# EAGLE design W034X (EAGLE 6.6.0)
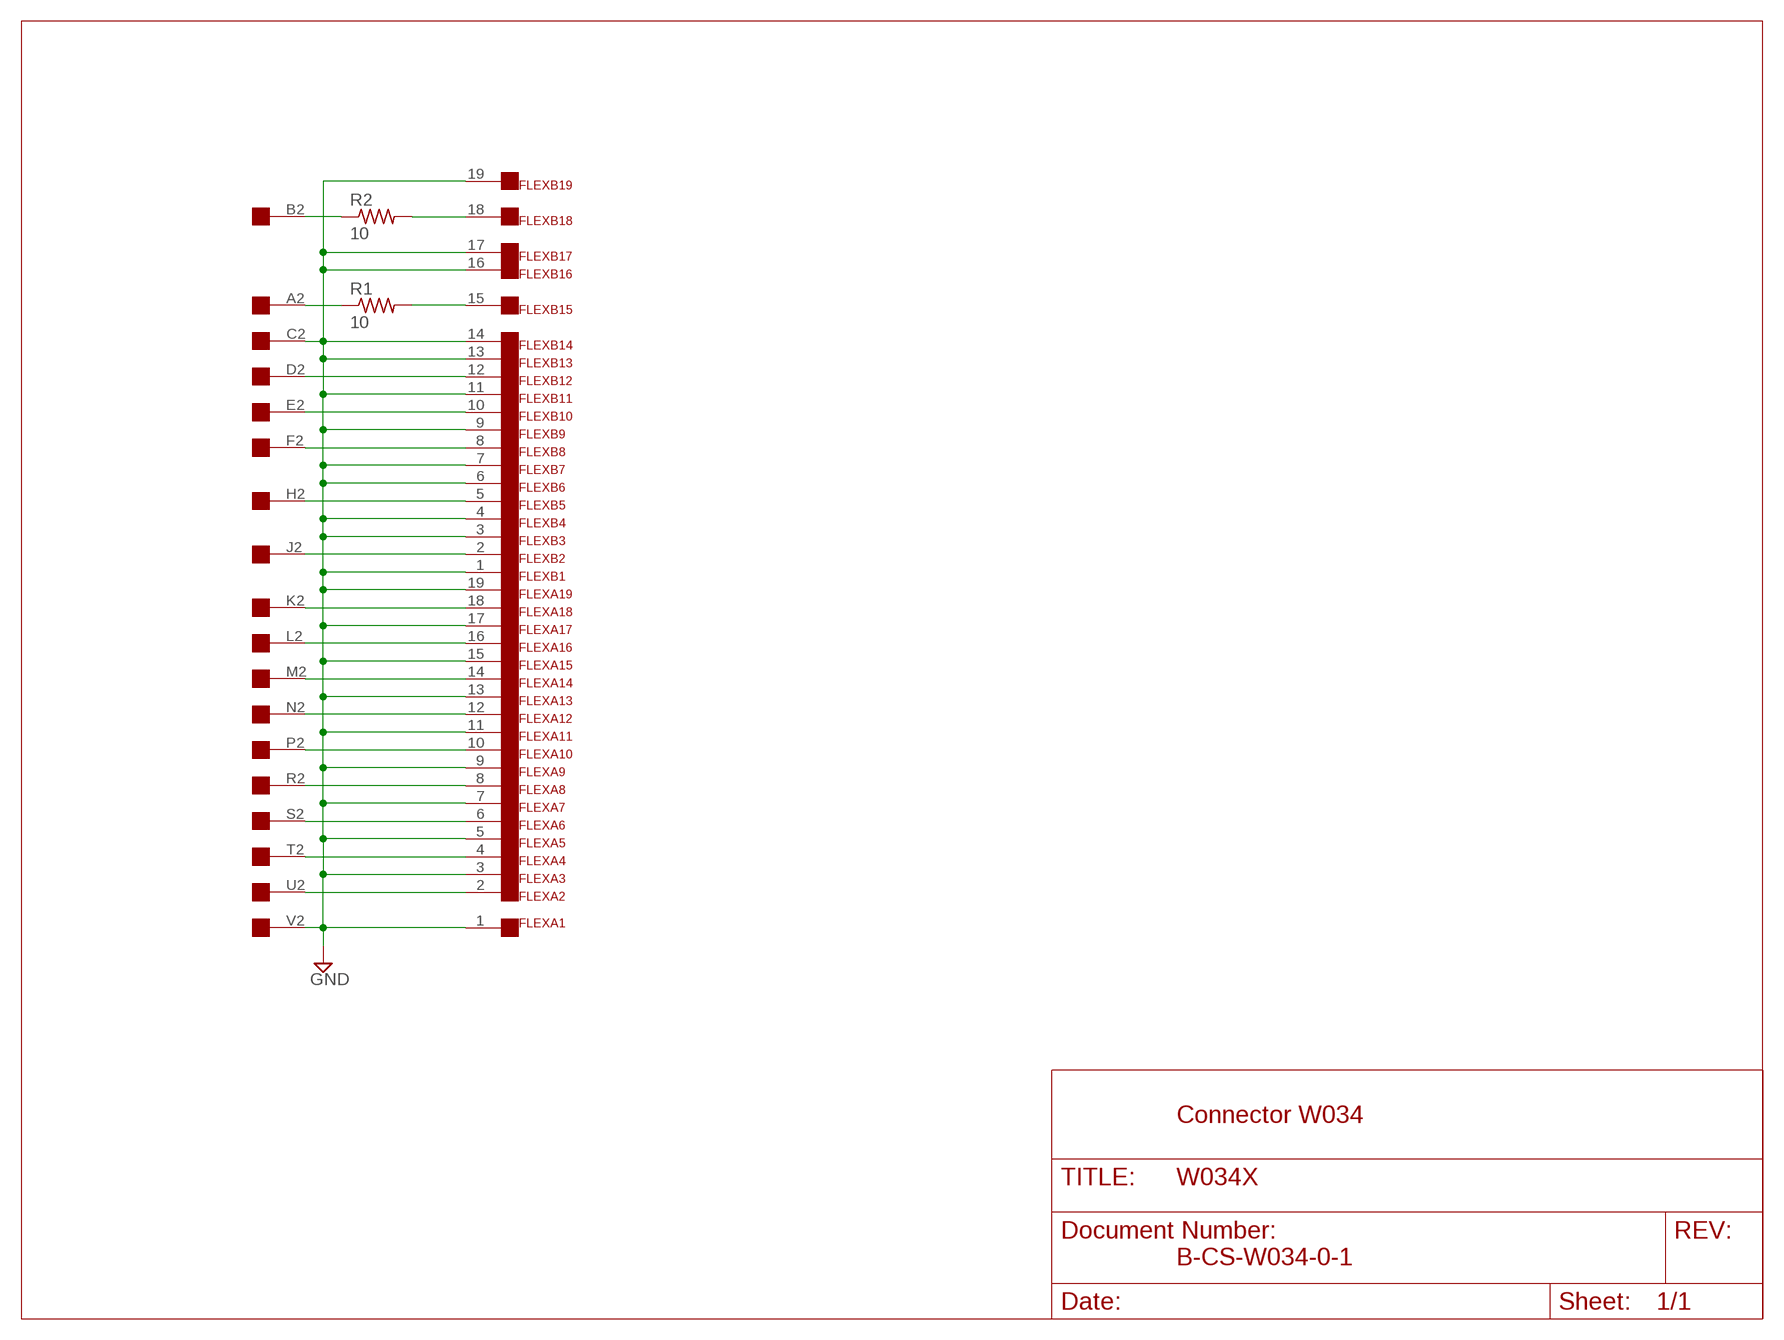
[diagram p0: schematic, sheet 1]

## Parts
FLEXA  FLEX19  [FLEX19]
FLEXB  FLEX19  [FLEX19]
R1  10  R-US_0207/10  [0207/10]
R2  10  R-US_0207/10  [0207/10]
U$2  EDGE-1  [EDGE-CON1]

## Nets
GND [Supply]: FLEXA.1 FLEXA.3 FLEXA.5 FLEXA.7 FLEXA.9 FLEXA.11 FLEXA.13 FLEXA.15 FLEXA.17 FLEXA.19 FLEXB.1 FLEXB.3 FLEXB.4 FLEXB.6 FLEXB.7 FLEXB.9 FLEXB.11 FLEXB.13 FLEXB.14 FLEXB.16 FLEXB.17 FLEXB.19 U$2.C2 U$2.V2
N$1 [Supply]: FLEXB.10 U$2.E2
N$2 [Supply]: FLEXB.5 U$2.H2
N$3 [Supply]: FLEXA.18 U$2.K2
N$4 [Supply]: FLEXA.14 U$2.M2
N$5 [Supply]: FLEXA.10 U$2.P2
N$6 [Supply]: FLEXA.6 U$2.S2
N$7 [Supply]: FLEXA.4 U$2.T2
N$8 [Supply]: FLEXA.8 U$2.R2
N$9: FLEXB.12 U$2.D2
N$10: R2.1 U$2.B2
N$11: R1.1 U$2.A2
N$12: FLEXB.18 R2.2
N$13: FLEXB.15 R1.2
N$14 [Supply]: FLEXA.2 U$2.U2
N$16 [Supply]: FLEXB.8 U$2.F2
N$17 [Supply]: FLEXB.2 U$2.J2
N$18 [Supply]: FLEXA.16 U$2.L2
N$19 [Supply]: FLEXA.12 U$2.N2

## Notes on the sheet
- Connector W034
- B-CS-W034-0-1

## Library data of the parts
FLEXA FLEXB = dec-con:FLEX19: 19 pin Flexprint Connection
R1 R2 = rcl:R-US_: RESISTOR, American symbol
U$2 = dec-con:EDGE-1: Single-Sided DEC Edge Connector -- (side 2)

## Net classes
0 default: width 0.813 mm
1 Supply: width 0.813 mm

## Board
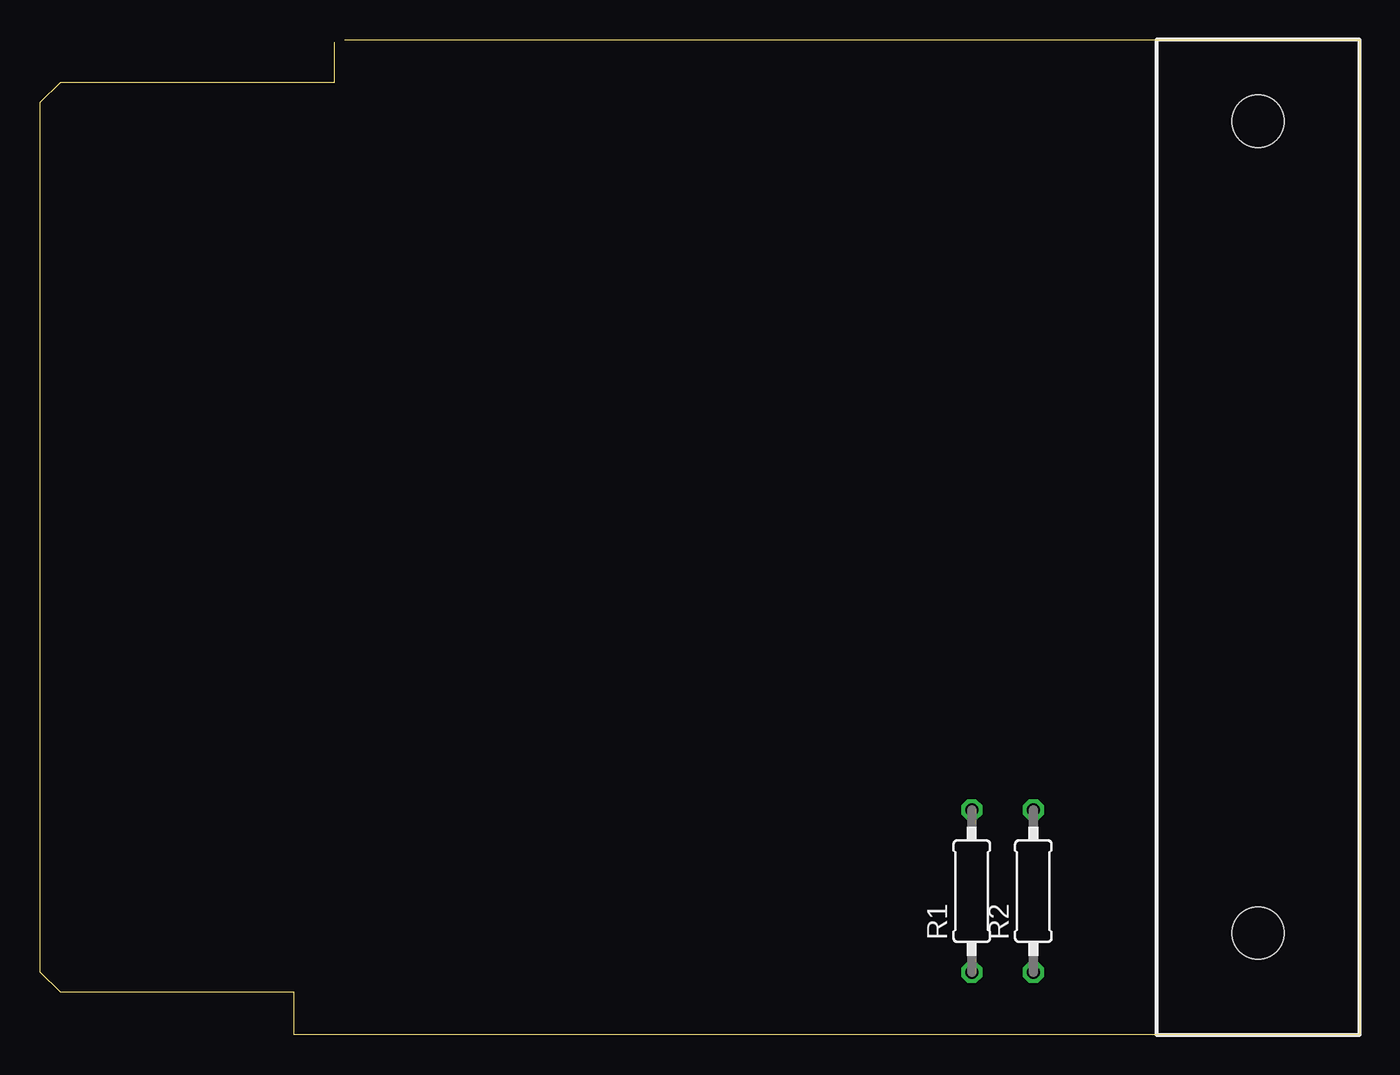
[diagram p1: board, top side]
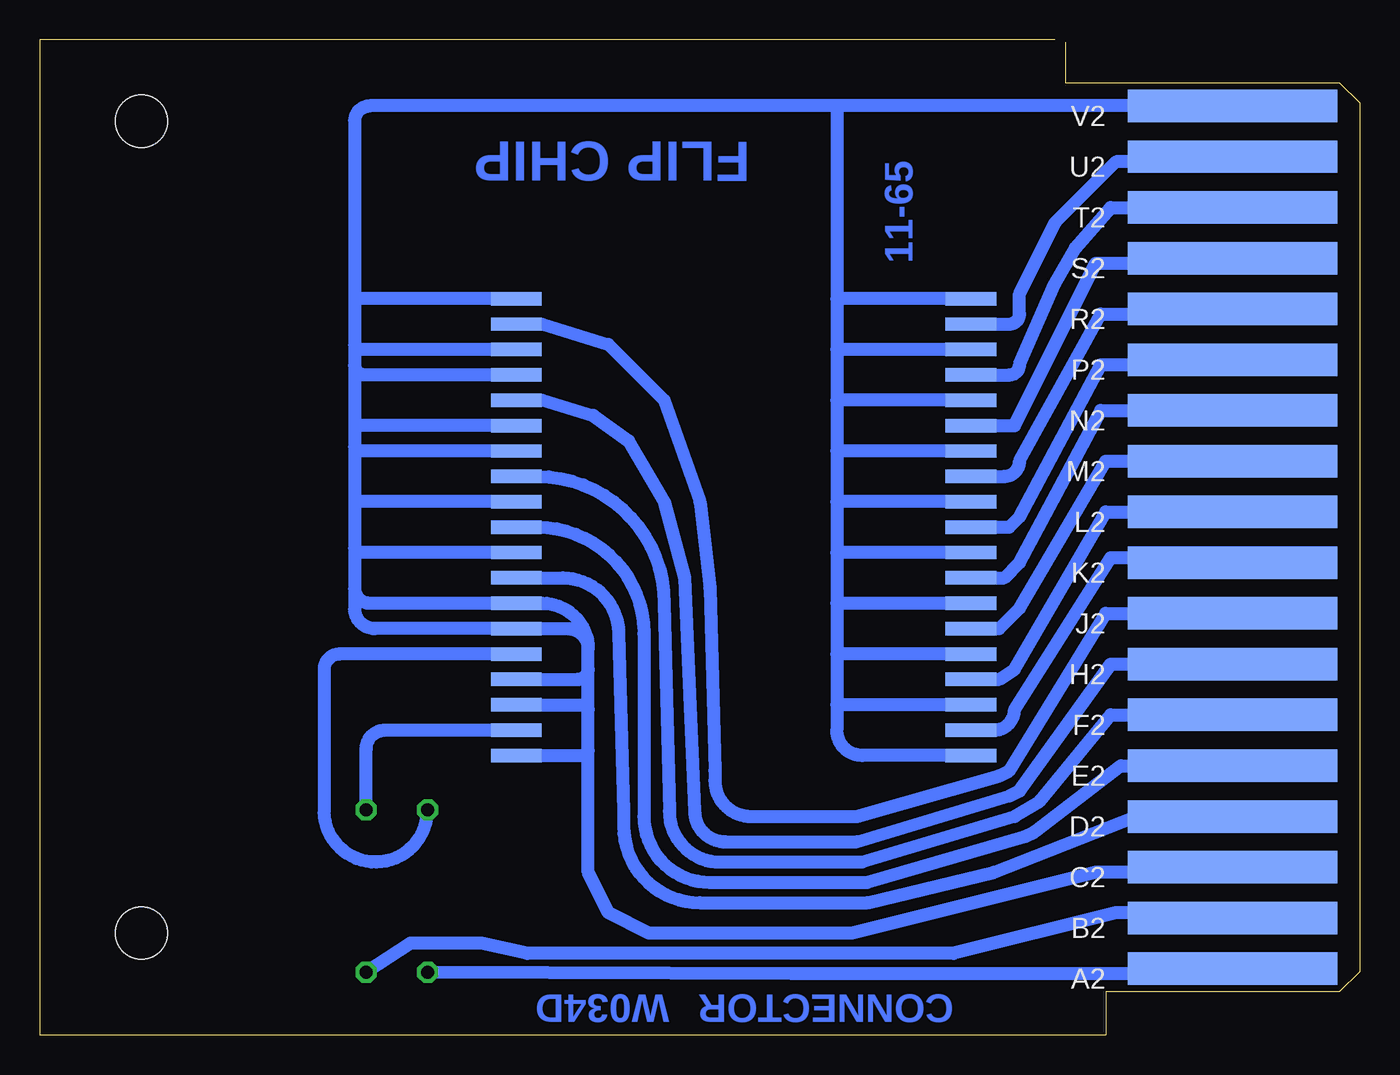
[diagram p2: board, bottom side, seen from below]

Size 82.55 x 62.23 mm. Coordinates in mm from the lower left corner, seen from the top.
Outline: 19.05,62.23 82.55,62.23 82.55,0 15.88,0
Copper layers (1+16): Top 0.035mm / dielectric 1.5mm / Bottom 0.035mm
Design rules "16mils": minimum track width 16mil, minimum drill 32mil, track to track 15mil, track to pad 10mil, pad to pad 10mil, via to via 10mil, smd to smd 10mil, copper to edge 13mil, drill to drill 10mil, minimum pad ring 10mil, minimum via ring 8mil, stop-mask expansion 0mil, vias tented up to drill 0mil, thermal gap 10mil
Holes 3.25 mm at 76.2,6.35 76.2,57.15

### Footprints (pad centres in the part's own frame; a part is rotated, then mirrored left to right if it is on the bottom)
FLEX19 = smd 3.175 x 0.838: 1 0,14.287; 2 0,12.7; 3 0,11.113; 4 0,9.525; 5 0,7.938; 6 0,6.35; 7 0,4.763; 8 0,3.175; 9 0,1.587; 10 0,0; 11 0,-1.587; 12 0,-3.175; 13 0,-4.763; 14 0,-6.35; 15 0,-7.938; 16 0,-9.525; 17 0,-11.113; 18 0,-12.7; 19 0,-14.287
0207/10 = drill 0.813 octagon: 1 -5.08,0; 2 5.08,0
EDGE-CON1 = smd 13.106 x 2.032 bottom: A2 7.938,4.128; B2 7.938,7.303; C2 7.938,10.477; D2 7.938,13.652; E2 7.938,16.828; F2 7.938,20.003; H2 7.938,23.177; J2 7.938,26.352; K2 7.938,29.527; L2 7.938,32.703; M2 7.938,35.877; N2 7.938,39.053; P2 7.938,42.227; R2 7.938,45.403; S2 7.938,48.578; T2 7.938,51.752; U2 7.938,54.928; V2 7.938,58.102

### Placement (x,y rotation side)
FLEXA  24.3,31.75 0 bottom
FLEXB  52.75,31.75 0 bottom
R1  58.29,8.97 90 top
R2  62.14,8.97 90 top
U$2  0,0 0 top

### Tracks (layer width: path | path; a pad name or v marks a point on that pad's centre or on a via)
GND
  Bottom 0.813: U$2.V2 32.7,58.1 | 32.7,58.1 32.7,46.04 | 32.7,46.04 32.7,42.86 | 32.7,42.86 32.7,39.69 | 32.7,39.69 32.7,36.51 | 32.7,36.51 32.7,33.34 | 32.7,33.34 32.7,30.16 | 32.7,30.16 32.7,26.99 | 32.7,26.99 32.7,23.81 | 32.7,23.81 32.7,20.64 | 32.7,20.64 32.7,19.05 arc-90 31.11,17.46 FLEXA.19 | 32.7,58.1 61.91,58.1 arc-90 62.87,57.15 62.87,45.72 | 62.87,45.72 62.87,43.18 | 62.87,43.18 62.87,41.91 | 62.87,41.91 62.87,38.1 | 62.87,38.1 62.87,36.83 | 62.87,36.83 62.87,33.02 | 62.87,33.02 62.87,30.48 | 62.87,30.48 62.87,27.94 | 62.87,27.94 62.87,26.67 arc-90 61.59,25.4 53.34,25.4 | FLEXA.17 32.7,20.64 | FLEXA.15 32.7,23.81 | FLEXA.13 32.7,26.99 | FLEXA.11 32.7,30.16 | FLEXA.9 32.7,33.34 | FLEXA.7 32.7,36.51 | FLEXA.5 32.7,39.69 | FLEXA.3 32.7,42.86 | FLEXA.1 32.7,46.04 | U$2.C2 8.89,10.16 16.51,10.16 31.75,6.35 44.45,6.35 46.99,7.62 48.26,10.16 48.26,17.78 | 48.26,17.78 48.26,20.32 | 48.26,20.32 48.26,22.86 | 48.26,22.86 48.26,24.13 | FLEXB.19 48.58,17.46 arc-90 48.26,17.78 | FLEXB.17 48.58,20.64 arc90 48.26,20.32 | FLEXB.16 48.9,22.23 arc-90 48.26,22.86 | FLEXB.14 49.53,25.4 arc90 48.26,24.13 | 48.26,24.13 arc-90 51.12,26.99 FLEXB.13 61.91,26.99 arc90 62.87,27.94 | FLEXB.1 62.55,46.04 arc-90 62.87,45.72 | FLEXB.3 62.55,42.86 arc90 62.87,43.18 | FLEXB.4 62.23,41.27 arc90 62.87,41.91 | FLEXB.6 62.87,38.1 | FLEXB.7 62.55,36.51 arc90 62.87,36.83 | FLEXB.9 62.55,33.34 arc-90 62.87,33.02 | FLEXB.11 62.55,30.16 arc90 62.87,30.48
N$1
  Bottom 0.813: FLEXB.10 51.44,31.75 arc90 44.77,25.08 44.77,13.65 arc-90 40.64,9.53 30.8,9.53 20.95,12.38 20.32,12.7 14.92,16.83 U$2.E2
N$2
  Bottom 0.813: FLEXB.5 51.12,39.69 47.94,38.73 45.72,37.15 43.5,33.34 42.23,28.57 41.59,13.97 arc-90 39.69,12.06 31.43,12.06 21.91,14.92 21.27,15.24 15.56,23.18 U$2.H2
N$3
  Bottom 0.813: FLEXA.18 22.86,19.05 arc-90 21.59,20.32 15.56,29.84 8.57,29.84 U$2.K2
N$4
  Bottom 0.813: FLEXA.14 22.54,25.4 21.27,26.67 15.88,35.88 U$2.M2
N$5
  Bottom 0.813: FLEXA.10 21.91,31.75 21.27,32.38 16.19,41.91 8.57,41.91 U$2.P2
N$6
  Bottom 0.813: FLEXA.6 21.59,38.1 16.51,48.26 8.89,48.26 U$2.S2
N$7
  Bottom 0.813: FLEXA.4 21.91,41.27 arc-90 21.27,41.91 19.05,46.99 17.78,49.21 15.56,51.75 U$2.T2
N$8
  Bottom 0.813: FLEXA.8 22.23,34.92 arc-90 21.27,35.88 16.19,45.09 8.89,45.09 U$2.R2
N$9
  Bottom 0.813: FLEXB.12 49.85,28.57 arc90 46.35,25.08 46.04,13.97 46.04,13.02 arc-90 41.27,8.26 30.8,8.26 22.86,10.16 13.97,13.65 U$2.D2
N$10
  Bottom 0.813: U$2.B2 8.89,7.62 15.24,7.62 25.4,5.08 52.07,5.08 54.93,5.71 59.37,5.71 R2.1
N$11
  Bottom 0.813: U$2.A2 8.89,3.81 35.56,3.81 R1.1
N$12
  Bottom 0.813: R2.2 62.14,17.87 arc90 60.96,19.05 FLEXB.18
N$13
  Bottom 0.813: FLEXB.15 63.82,23.81 arc-90 64.77,22.86 64.77,13.97 arc-180 58.34,14.05 R1.2
N$14
  Bottom 0.813: U$2.U2 8.89,54.93 8.89,54.61 15.24,54.61 19.05,50.8 21.27,46.35 21.27,45.09 arc90 21.91,44.45 FLEXA.2
N$16
  Bottom 0.813: FLEXB.8 51.44,34.92 arc90 43.5,26.99 43.18,13.97 arc-90 40.01,10.79 31.11,10.79 21.59,13.65 20,14.61 15.56,20 U$2.F2
N$17
  Bottom 0.813: FLEXB.2 51.12,44.45 46.99,43.18 43.5,39.69 41.27,33.34 40.64,27.94 40.32,16.51 40.32,15.88 arc-90 38.1,13.65 31.43,13.65 22.54,16.19 21.91,16.51 15.88,26.35 U$2.J2
N$18
  Bottom 0.813: FLEXA.16 22.54,22.23 21.59,22.86 15.88,32.7 U$2.L2
N$19
  Bottom 0.813: FLEXA.12 22.23,28.57 21.27,29.53 16.19,39.05 U$2.N2

### Text on the board
Bottom: FLIP CHIP | 11-65 | CONNECTOR | W034D
200bmp: C:/Users/Vince/Documents/eagle/projects/DEC/Wxxx/W034/W034Dbackfb.bmp